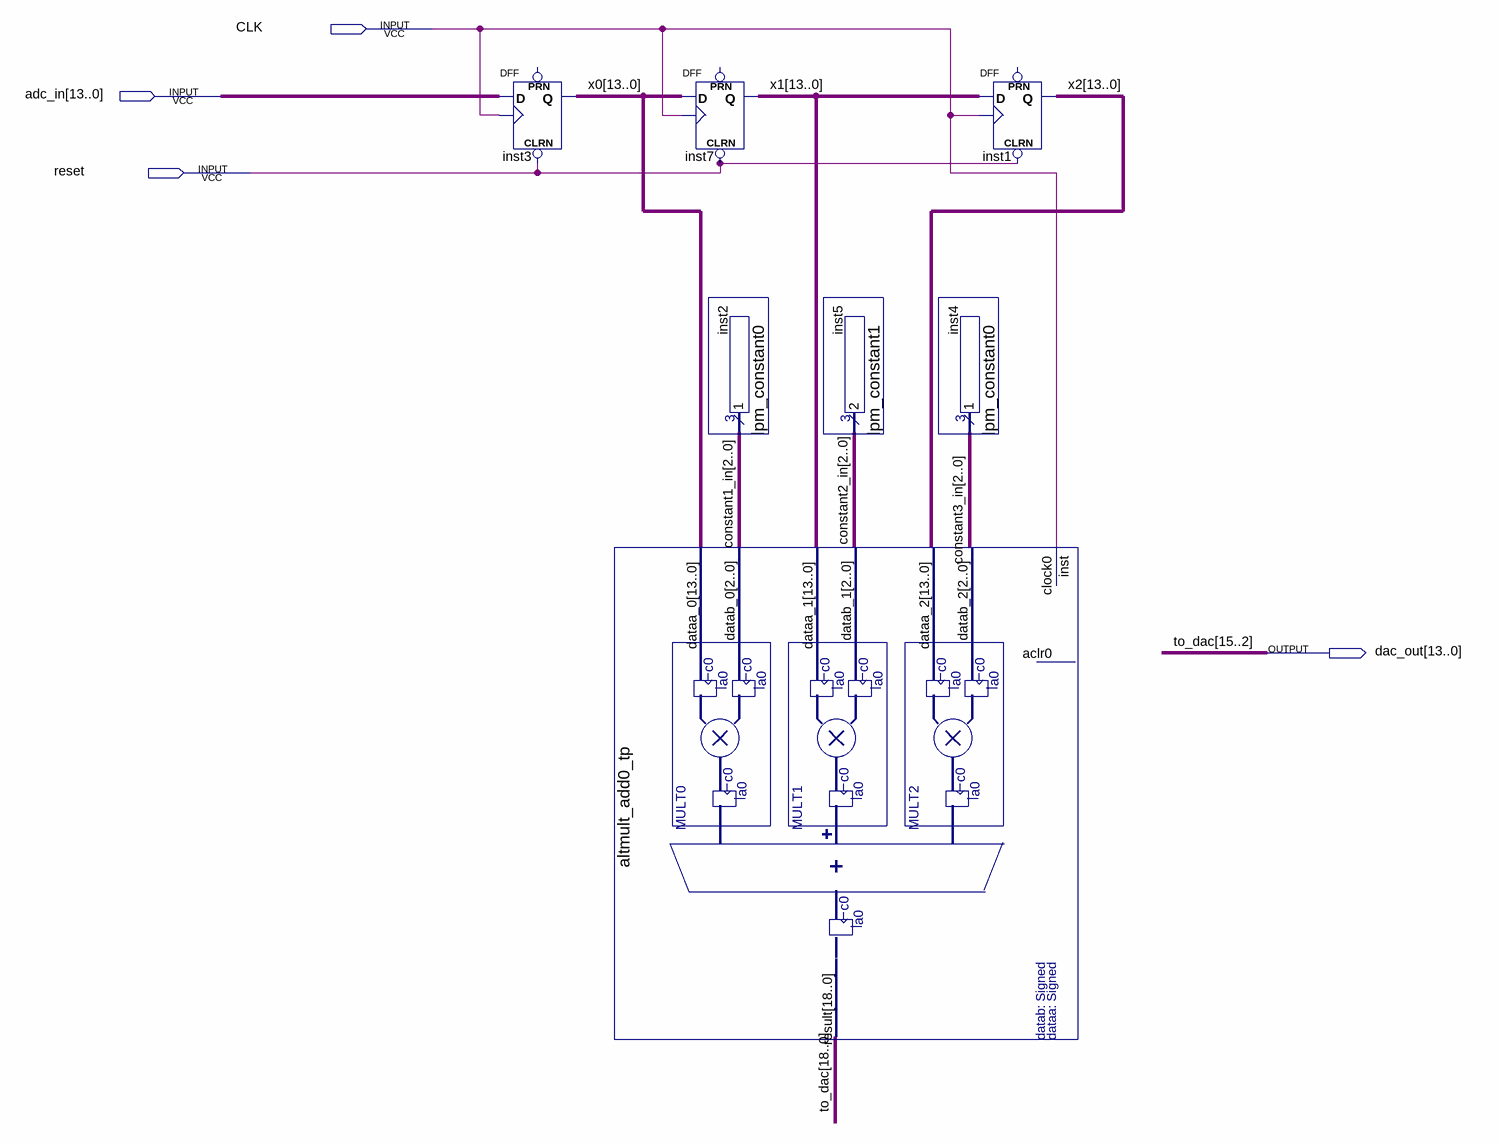
[diagram p0: schematic sheet]
// Quartus schematic tiefpass.bdf as structural Verilog: 7 symbols, 4 pins
module tiefpass (
  input  CLK,
  input  [13:0] adc_in,
  input  reset,
  output [13:0] dac_out
);

  wire [2:0] constant1_in, constant2_in, constant3_in;
  wire [13:0] x0, x1, x2;
  wire [18:0] to_dac;

  DFF inst3[13:0] (.CLRN(reset), .CLK(CLK), .D(adc_in), .Q(x0));  // open: PRN
  DFF inst7[13:0] (.CLRN(reset), .CLK(CLK), .D(x0), .Q(x1));  // open: PRN
  altmult_add0_tp inst (
    .dataa_0(x0), .datab_0(constant1_in), .dataa_1(x1), .datab_1(constant2_in), .dataa_2(x2),
    .datab_2(constant3_in), .clock0(CLK), .result({to_dac[18:16], dac_out, to_dac[1:0]}));  // open: aclr0
  lpm_constant0 inst2 (.result(constant1_in));
  lpm_constant1 inst5 (.result(constant2_in));
  DFF inst1[13:0] (.CLRN(reset), .CLK(CLK), .D(x1), .Q(x2));  // open: PRN
  lpm_constant0 inst4 (.result(constant3_in));

  // Other names for the same wires on the sheet: to_dac[15:2] = dac_out
endmodule
